# Altium schematic sheet BG_Sch.SchDoc
size A4
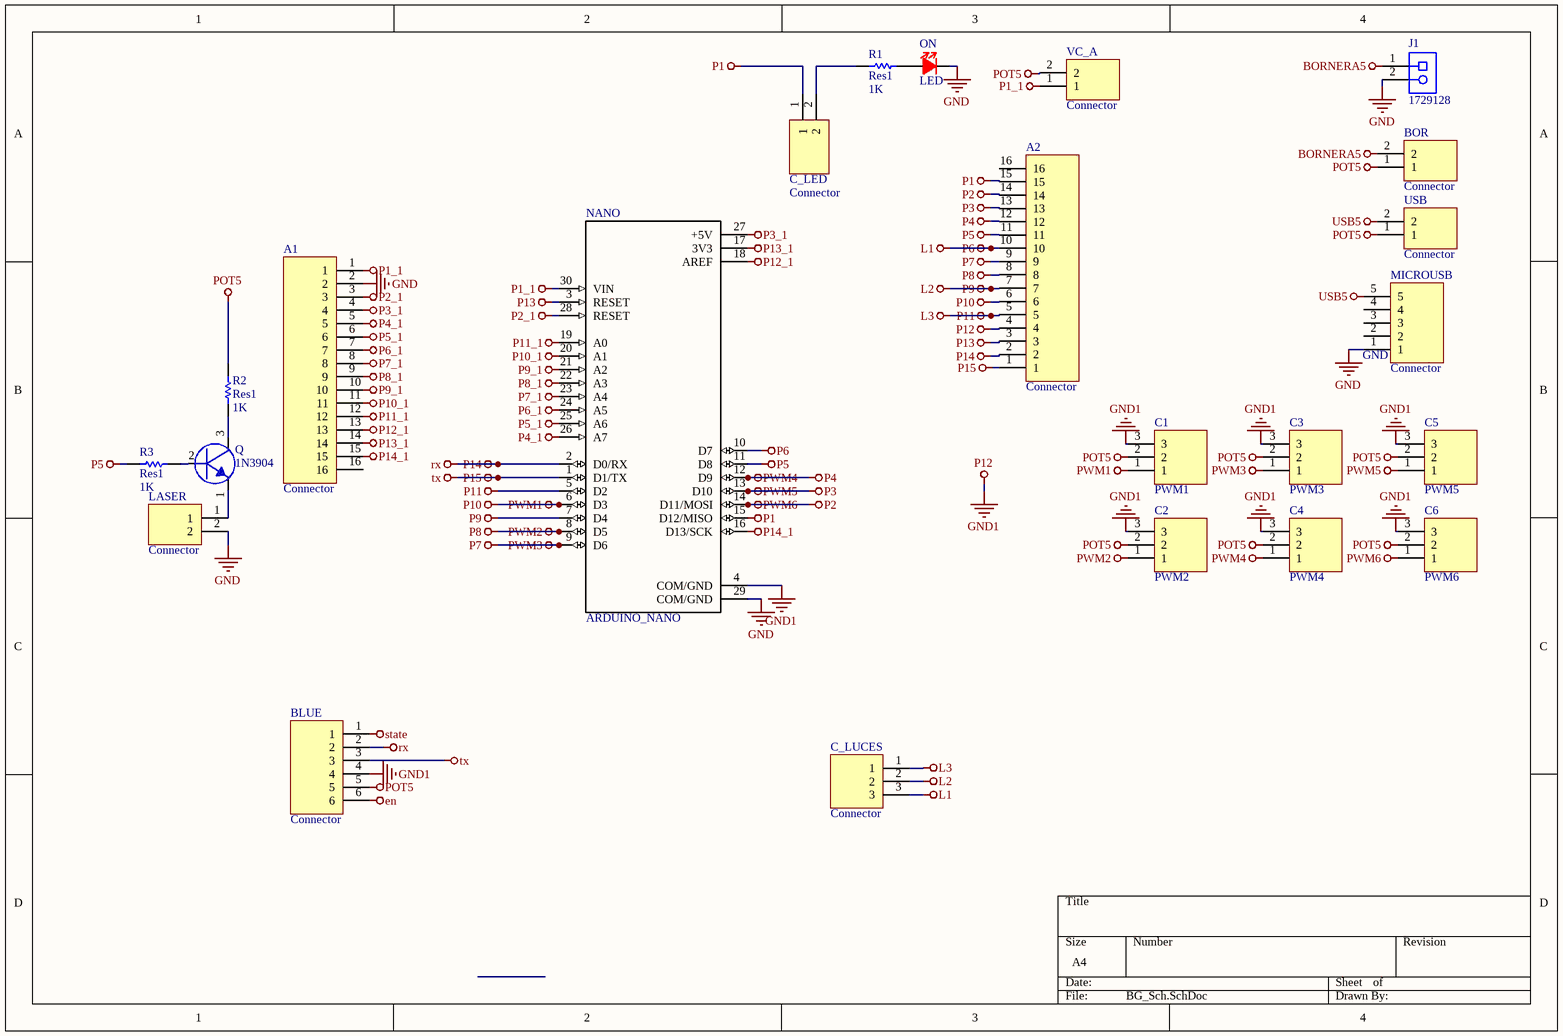
[diagram p0: BG_Sch.SchDoc]

## Parts
A1  Connector  [1x16x2.54 Pin Header TH V]
A2  Connector  [1x16x2.54 Pin Header TH V]
BLUE  Connector  [1x6x2.54 Pin Header TH V]
BOR  Connector  [1x2x2.54 Pin Header TH V]
C1  PWM1  [1x3x2.54 Pin Header TH V]
C2  PWM2  [1x3x2.54 Pin Header TH V]
C3  PWM3  [1x3x2.54 Pin Header TH V]
C4  PWM4  [1x3x2.54 Pin Header TH V]
C5  PWM5  [1x3x2.54 Pin Header TH V]
C6  PWM6  [1x3x2.54 Pin Header TH V]
C_LED  Connector  [1x2x2.54 Pin Header TH V]
C_LUCES  Connector  [1x3x2.54 Pin Header TH V]
J1  1729128  [PHOE-1729128-2_V]
LASER  Connector  [1x2x2.54 Pin Header TH V]
MICROUSB  Connector  [1x5x2.54 Pin Header TH V]
NANO  ARDUINO_NANO  [*SHIELD_ARDUINO_NANO]
ON  LED  [LED Red 3mm TH V]
Q  1N3904  [TO92-2.54]
R1  Res1  value 1K  [AXIAL-0.3]
R2  Res1  value 1K  [AXIAL-0.3]
R3  Res1  value 1K  [AXIAL-0.3]
USB  Connector  [1x2x2.54 Pin Header TH V]
VC_A  Connector  [1x2x2.54 Pin Header TH V]

## Nets
BORNERA5: BOR.2 J1.1
en: BLUE.6
GND: A1.2 J1.2 LASER.2 MICROUSB.1 NANO.29(COM/GND) ON.1
GND1: A2.4 BLUE.4 C1.3 C2.3 C3.3 C4.3 C5.3 C6.3 NANO.4(COM/GND)  [also labelled P12]
L1: A2.10 C_LUCES.3 NANO.10(D7)  [also labelled P6]
L2: A2.7 C_LUCES.2 NANO.7(D4)  [also labelled P9]
L3: A2.5 C_LUCES.1 NANO.5(D2)  [also labelled P11]
P1: A2.15 C_LED.1 NANO.15(D12/MISO)
P1_1: A1.1 NANO.30(VIN) VC_A.1
P2: A2.14 C6.1 NANO.14(D11/MOSI)  [also labelled PWM6]
P2_1: A1.3 NANO.28(RESET)
P3: A2.13 C5.1 NANO.13(D10)  [also labelled PWM5]
P3_1: A1.4 NANO.27(+5V)
P4: A2.12 C4.1 NANO.12(D9)  [also labelled PWM4]
P4_1: A1.5 NANO.26(A7)
P5: A2.11 NANO.11(D8) R3.1
P5_1: A1.6 NANO.25(A6)
P6_1: A1.7 NANO.24(A5)
P7: A2.9 C3.1 NANO.9(D6)  [also labelled PWM3]
P7_1: A1.8 NANO.23(A4)
P8: A2.8 C2.1 NANO.8(D5)  [also labelled PWM2]
P8_1: A1.9 NANO.22(A3)
P9_1: A1.10 NANO.21(A2)
P10: A2.6 C1.1 NANO.6(D3)  [also labelled PWM1]
P10_1: A1.11 NANO.20(A1)
P11_1: A1.12 NANO.19(A0)
P12_1: A1.13 NANO.18(AREF)
P13: A2.3 NANO.3(RESET)
P13_1: A1.14 NANO.17(3V3)
P14: A2.2 BLUE.2 NANO.2(D0/RX)  [also labelled rx]
P14_1: A1.15 NANO.16(D13/SCK)
P15: A2.1 BLUE.3 NANO.1(D1/TX)  [also labelled tx]
POT5: BLUE.5 BOR.1 C1.2 C2.2 C3.2 C4.2 C5.2 C6.2 R2.2 USB.1 VC_A.2
state: BLUE.1
USB5: MICROUSB.5 USB.2
NetC_LED_2: C_LED.2 R1.1
NetLASER_1: LASER.1 Q.1
NetON_2: ON.2 R1.2
NetQ_2: Q.2 R3.2
NetQ_3: Q.3 R2.1

Not connected (* = marked no-connect by the designer): A1 16; A2 16; MICROUSB 2 3 4

## Notes on the sheet
- (near MICROUSB) GND

## Library data of the parts
A1 A2 = Header 1x16
BLUE = Header 1x6
BOR C_LED LASER USB VC_A = Header 1x2
C1-C6 C_LUCES = Header 1x3
J1 = CMP-2000-05815-1: PCB Terminal Block, 13.5 A, 400 V, 2-Pin THD, RoHS, Bulk; Manufacturer: Phoenix Contact; Package Version: 03/2015; No. of Rows: 1; Pitch: 5.08mm; No. of Positions: 2; Voltage Rating: 400V; Current Rating: 13500mA; Manufacturer URL: http://www.phoenixcontact.com/; Datasheet URL: https://datasheet.ciiva.com/16046/1729128-16046181.pdf; RoHS: TRUE; Package URL: https://www.phoenixcontact.com/online/portal/pi/pxc/product_detail_page/!ut/p/b1/3VdJjqNKFDxLH8AFycySyWY2ozFsEPOMMQaDOX1XedGL_1Vdm5YXJleknhSKeBkvI6EA8ncAo3AYoDhBQGco6KN7VURTdemj9us_IEKEZo_YHiPAEWEFmDGOHMORkqKYCORBZxgL7ZoaZYcbFFUZ3fqxSY6GOuxydWUuHqz1ynmMFygu583Bob0Ewr6Sd_l-5m-kAueHiB0jpRwZwe58wwtkpxtMYd_LmGcDRU02dRNEyWt6Y2ti5pSyJ_reIkzIulrqApdnbT11V5jnCKbYNCvhEM1MCpPByat_X379-iThf08CI5GfOPqfBeS3BRoBOdD55AKVv0iLwCMq-2BrzXWSGRH7pUGD9uwXQjiph3xL0DKQwdGa0JImiIOmBNOestqgwTHSSs2oOep-78apyXQBvNi8ZLaFjvjWvcaUEBu0MC6Wbe-d6mB0FAebo2lUWinqYaZs5DAYzV0RP9yitUjnGJ0iI9xhZkT42OCQNUJJhkgWINNQLP2JFP6OpMg3JCVg70jqHT0lvKOnhHf0lPuOnnLf0VPuWx6_dxwUIvwk5WMkT0kLL1mh61l2yZVSzG3pYV_bqo-mj6uMKwKwdnnW8Jh5RTOJzMOA5c-eJDaZQw4mTMPH02PvS_ZAqNVjVTo2WyYLkwH_KU1mmmG5kjRhDqPXLwwVHvVOjCM60-fpXvTDfMGW1PVFVS1r4e4yVDk4ZdNbkUHvqPqQSeian4UD39fNKmachqdJ1NJbyk8rXT9mXTvPk3oE5meulKGgiruPJek-4I9hTT6G8ZLOyRSm2RRVbThERQad5OS28hdt4YW4vG0stgYYzsWsK4_7y6DZMjJSCqri1kyiZR5vD7pwIrNR7QwPHTcLTI5qT7eRlpHrdGiupYlqQDJ7zy_CND8fWWBoLRXxk1RVcXiBQwbTD4Xi7KL-FuO94t9xaqweXzH; PartNumber: 1729128; Package Description: 2-Pin Through Hole Device, Body 8.1 x 10.16 mm, Pitch 5.08 mm; Datasheet Version: 12/2013; Mounting Technology: ThroughHole; Orientation: Horizontal; Package Reference: 1729128-2; Packing: Bulk
MICROUSB = Header 1x5
NANO = ARDUINO_NANO: / ATmega328 Arduino Nano AVRÂ® ATmega AVR MCU 8-Bit Embedded Evaluation Board /; Package: None; MP: ARDUINO NANO; SnapEDA_Link: https://www.snapeda.com/parts/ARDUINO%20NANO/Arduino/view-part/1128261/?ref=snap; Availability: Unavailable; Price: None; MF: Arduino; Value: *
ON = LED Red
Q = 1N3904: 1N3904 NPN Transistor
R1-R3 = Res1: Resistor; Published: 8-Jun-2000; LatestRevisionDate: 17-Jul-2002; LatestRevisionNote: Re-released for DXP Platform.; PackageReference: AXIAL-0.3; Publisher: Altium Limited; PackageDescription: Axial Device, Thru-Hole; 2 Leads; 0.3 in Pin Spacing